# Altium project 24V_Supply.PrjPcb
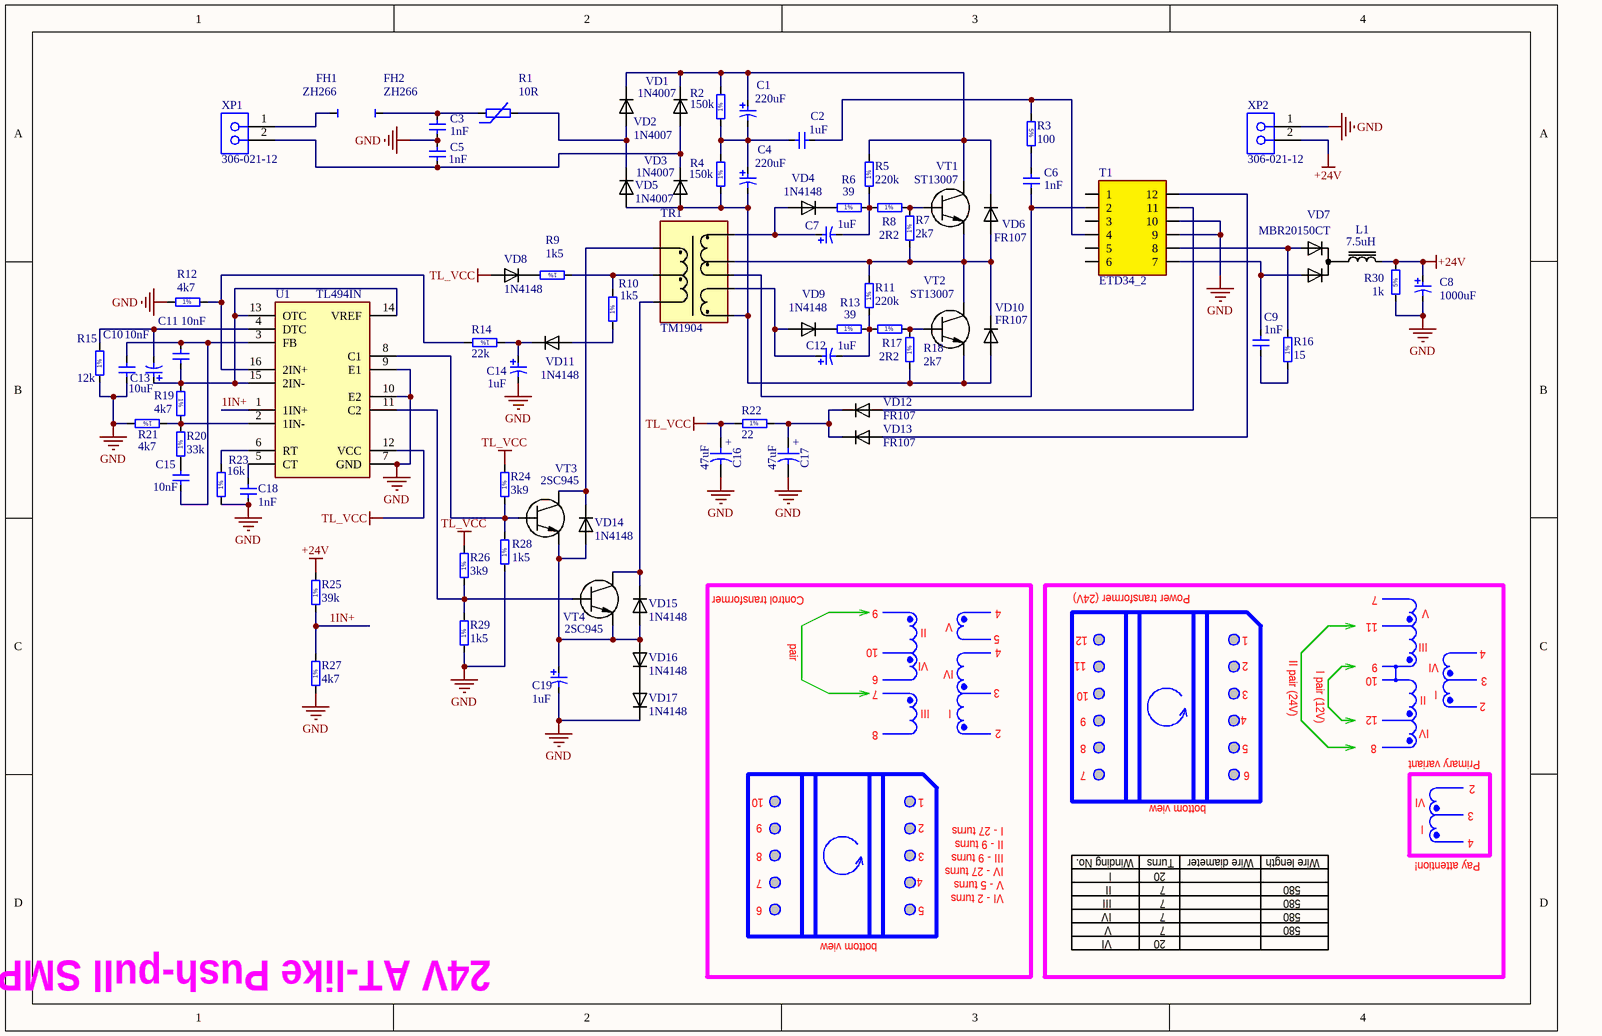
[diagram p0: 24V_Supply.SchDoc]
1 sheet, 78 parts. Net scope: global (net labels, ports and power ports of the same name join across sheets).
Board file: 24V_Supply.PcbDoc

## Sheet 24V_Supply.SchDoc
size A4

### Parts
C1  220uF  [CAP_EL_22_25_VERT]
C2  1uF  [CAPRR2000W80L2400T750H1500_CL21]
C3  1nF  [CAP_5.0MM]
C4  220uF  [CAP_EL_22_25_VERT]
C5  1nF  [CAP_5.0MM]
C6  1nF  [CAP_5.0MM]
C7  1uF  [CAP_EL_05_11_VERT]
C8  1000uF  [CAP_EL_13_20_VERT]
C9  1nF  [CAP_5.0MM]
C10  10nF  [CAP_5.0MM]
C11  10nF  [CAP_5.0MM]
C12  1uF  [CAP_EL_05_11_VERT]
C13  10uF  [CAP_EL_05_11_VERT]
C14  1uF  [CAP_EL_05_11_VERT]
C15  10nF  [CAP_5.0MM]
C16  47uF  [CAPPR250-500X1100]
C17  47uF  [CAPPR250-500X1100]
C18  1nF  [CAP_5.0MM]
C19  1uF  [CAP_EL_05_11_VERT]
FH1  ZH266  [ZH266]
FH2  ZH266  [ZH266]
L1  7.5uH  [DGS]
R1  10R  [B57164K]
R2  150k  [RES_AXIAL_0_25_8]
R3  100  [RES_VERT_2W_5]
R4  150k  [RES_AXIAL_0_25_8]
R5  220k  [RES_AXIAL_0_25_8]
R6  39  [RES_AXIAL_0_25_8]
R7  2k7  [RES_AXIAL_0_25_8]
R8  2R2  [RES_AXIAL_0_25_8]
R9  1k5  [RES_AXIAL_0_25_8]
R10  1k5  [RES_AXIAL_0_25_8]
R11  220k  [RES_AXIAL_0_25_8]
R12  4k7  [RES_AXIAL_0_25_8]
R13  39  [RES_AXIAL_0_25_8]
R14  22k  [RES_AXIAL_0_25_8]
R15  12k  [RES_AXIAL_0_25_8]
R16  15  [RES_AXIAL_0_25_8]
R17  2R2  [RES_AXIAL_0_25_8]
R18  2k7  [RES_AXIAL_0_25_8]
R19  4k7  [RES_AXIAL_0_25_8]
R20  33k  [RES_AXIAL_0_25_8]
R21  4k7  [RES_AXIAL_0_25_8]
R22  22  [RES_AXIAL_0_25_8]
R23  16k  [RES_AXIAL_0_25_8]
R24  3k9  [RES_AXIAL_0_25_8]
R25  39k  [RES_AXIAL_0_25_8]
R26  3k9  [RES_AXIAL_0_25_8]
R27  4k7  [RES_AXIAL_0_25_8]
R28  1k5  [RES_AXIAL_0_25_8]
R29  1k5  [RES_AXIAL_0_25_8]
R30  1k  [RES_VERT_2W_5]
T1  ETD34_2  [ETD34_2]
TR1  TM1904  [TM1904]
U1  TL494IN  [DIP16]
VD1  1N4007  [DO-41]
VD2  1N4007  [DO-41]
VD3  1N4007  [DO-41]
VD4  1N4148  [DO-35(300mil)]
VD5  1N4007  [DO-41]
VD6  FR107  [DO-41]
VD7  MBR20150CT  [TO-220-3]
VD8  1N4148  [DO-35(300mil)]
VD9  1N4148  [DO-35(300mil)]
VD10  FR107  [DO-41]
VD11  1N4148  [DO-35]
VD12  FR107  [DO-41 (8.5mm)]
VD13  FR107  [DO-41 (8.5mm)]
VD14  1N4148  [DO-35]
VD15  1N4148  [DO-35]
VD16  1N4148  [DO-35]
VD17  1N4148  [DO-35]
VT1  ST13007  [TO-220-3]
VT2  ST13007  [TO-220-3]
VT3  2SC945  [TO92]
VT4  2SC945  [TO92]
XP1  306-021-12  [306-021-12]
XP2  306-021-12  [306-021-12]

### Nets
+24V: C8.1 L1.2 R25.2 R30.2 XP2.2
GND: C3.1 C5.2 C8.2 C10.1 C14.2 C16.2 C17.2 C18.1 C19.2 R12.1 R15.1 R21.2 R23.1 R27.1 R28.1 R29.1 R30.1 T1.9 T1.10 U1.7(GND) U1.9(E1) U1.10(E2) VD17.K XP2.1
TL_VCC: C16.1 R22.1 R24.2 R26.2 U1.12(VCC) VD8.A
1IN+: R25.1 R27.2 U1.1(1IN+)
NetC1_1: C1.1 R2.2 R5.2 VD1.K VD2.K VD6.K VT1.2(C)
NetC1_2: C1.2 C2.1 C4.1 R2.1 R4.2
NetC2_2: C2.2 R3.1 T1.4
NetC3_2: C3.2 FH2.1 R1.1
NetC4_2: C4.2 R4.1 R18.1 TR1.7 VD3.A VD5.A VD10.A VT2.3(E)
NetC5_1: C5.1 VD1.A VD3.K XP1.2
NetC6_1: C6.1 T1.2 TR1.6
NetC6_2: C6.2 R3.2
NetC7_1: C7.1 TR1.9 VD4.A
NetC7_2: C7.2 R5.1 R6.2 R8.1
NetC9_1: C9.1 R16.1
NetC9_2: C9.2 T1.7 VD7.1(A)
NetC10_2: C10.2 C11.2 C15.1 U1.3(FB)
NetC11_1: C11.1 C13.1 R19.1 U1.13(OTC) U1.14(VREF) U1.15(2IN-)
NetC12_1: C12.1 TR1.8 VD9.A
NetC12_2: C12.2 R11.1 R13.2 R17.1
NetC13_2: C13.2 R15.2 U1.4(DTC)
NetC14_1: C14.1 R14.1 VD11.K
NetC15_2: C15.2 R20.1
NetC17_1: C17.1 R22.2 VD12.K VD13.K
NetC18_2: C18.2 U1.5(CT)
NetC19_1: C19.1 VD14.A VD15.A VD16.A VT3.3(E) VT4.3(E)
NetFH1_1: FH1.1 XP1.1
NetL1_1: L1.1 VD7.2(K)
NetR1_2: R1.2 VD2.A VD5.K
NetR6_1: R6.1 VD4.K
NetR7_1: R7.1 R11.2 TR1.10 VD6.A VD10.K VT1.3(E) VT2.2(C)
NetR7_2: R7.2 R8.2 VT1.1(B)
NetR9_1: R9.1 R10.2 TR1.3
NetR9_2: R9.2 VD8.K
NetR10_1: R10.1 VD11.A
NetR12_2: R12.2 R14.2 U1.16(2IN+)
NetR13_1: R13.1 VD9.K
NetR16_2: R16.2 T1.8 VD7.3(A)
NetR17_2: R17.2 R18.2 VT2.1(B)
NetR19_2: R19.2 R20.2 R21.1 U1.2(1IN-)
NetR23_2: R23.2 U1.6(RT)
NetR24_1: R24.1 R28.2 U1.8(C1) VT3.1(B)
NetR26_1: R26.1 R29.2 U1.11(C2) VT4.1(B)
NetT1_11: T1.11 VD12.A
NetT1_12: T1.12 VD13.A
NetTR1_2: TR1.2 VD15.K VT4.2(C)
NetTR1_4: TR1.4 VD14.K VT3.2(C)
NetVD16_K: VD16.K VD17.A

Not connected (* = marked no-connect by the designer): T1 1 3 5 6

### Notes on the sheet
- Power transformer (24V)
- pair
- Control transformer
- 9
- 10
- II
- VI
- V
- 5
- 4
- 11
- 12
- 1
- 2
- II pair (24V)
- 7
- III
- 6
- I
- IV
- 3
- I pair (12V)
- 8
- Primary variant
- I - 27 turns
- II - 9 turns
- III - 9 turns
- Winding No.
- Turns
- bottom view
- Wire diameter
- Wire length
- Pay attention!
- IV - 27 turns
- V - 5 turns
- VI - 2 turns
- 20
- 580
- 24V AT-like Push-pull SMPS
- (in symbol CAER_47UF_25V_20%_250-500X1100) +
- (in symbol RCF_100R_5%_2W_HB) 5%
- (in symbol RMF_1K5_1%_0.6W_50PPM_1016-630X250) 1%
- (in symbol RMF_2K7_1%_0.6W_50PPM_1016-630X250) 1%
- (in symbol RMF_2R2_1%_0.6W_50PPM_1016-630X250) 1%
- (in symbol RMF_3K9_1%_0.6W_50PPM_1016-630X250) 1%
- (in symbol RMF_4K7_1%_0.6W_50PPM_1016-630X250) 1%
- (in symbol RMF_12K_1%_0.6W_50PPM_1016-630X250) 1%
- (in symbol RMF_15R_1%_0.6W_50PPM_1016-630X250) 1%
- (in symbol RMF_16K_1%_0.6W_50PPM_1016-630X250) 1%
- (in symbol RMF_22K_1%_0.6W_50PPM_1016-630X250) 1%
- (in symbol RMF_22R_1%_0.6W_50PPM_1016-630X250) 1%
- (in symbol RMF_33K_1%_0.6W_50PPM_1016-630X250) 1%
- (in symbol RMF_39R_1%_0.6W_50PPM_1016-630X250) 1%
- (in symbol RMF_150K_1%_0.6W_50PPM_1016-630X250) 1%
- (in symbol RMF_220K_1%_0.6W_50PPM_1016-630X250) 1%

### Library data of the parts
C1 C4 = LG200M0220BPF-2225 (VERT MOUNTED): Voltage: 200V; Table: Electrolytic THD; Part Number: LG200M0220BPF-2225 (VERT MOUNTED); Value: 220uF
C2 = К73-17-250-1 10%: SMD 0805 Capacitor; Voltage: 250V; Table: Film; Part Number: К73-17-250-1 10%; Value: 1uF
C3 C5 C6 C9 = CK45-B3DD102KYNN: SMD 0805 Capacitor; Voltage: 2000V; Tolerance: ±10%; Table: Ceramic THD; Part Number: CK45-B3DD102KYNN; Value: 1nF
C7 C12 C14 C19 = SH050M1R00B2F-0511 (VERT MOUNTED): Voltage: 50V; Table: Electrolytic THD; Part Number: SH050M1R00B2F-0511 (VERT MOUNTED); Value: 1uF
C8 = SK035M1000B5S-1320 (VERT MOUNTED): Voltage: 35V; Table: Electrolytic THD; Part Number: SK035M1000B5S-1320 (VERT MOUNTED); Value: 1000uF
C10 C11 C15 = TS170R1H103K8BBB0R: SMD 0805 Capacitor; Voltage: 50V; Tolerance: ±10%; Table: Ceramic THD; Part Number: TS170R1H103K8BBB0R; Value: 10nF
C13 = SH050M0010B2F-0511 (VERT MOUNTED): Voltage: 50V; Table: Electrolytic THD; Part Number: SH050M0010B2F-0511 (VERT MOUNTED); Value: 10uF
C16 C17 = CAER_47UF_25V_20%_250-500X1100: Polarised capacitor; Part Description: Aluminum Electrolytic Capacitor; Manufacturer: GENERIC; Manufacturer1 Part Number: EEUFC1E470; Voltage: 25V; Tolerance: ±20%; Table: Capacitors THD; Part Number: CAER_47UF_25V_20%_250-500X1100; Component Kind: Standard; Component Type: Standard; Pin Count: 2; Value: 47uF; Status: Preferred; Manufacturer Part Number: CAER_47UF_25V_20%_250-500X1100; Case: LS2.5 D5 x H11; Mounted: Yes; Socket: No; SMD: No; ComponentHeight: 11mm; Manufacturer1 Example: PANASONIC; Manufacturer1 ComponentHeight: 11mm; HelpURL: \\cern.ch\dfs\Applications\Altium\Datasheets\CAER_PANASONIC_FC.pdf; Author: CERN DEM JLC; CreateDate: 18.12.2007; LatestRevisionDate: 18.12.2007
C18 = TS170R1H102JSBNB0R: SMD 0805 Capacitor; Voltage: 50V; Tolerance: ±5%; Table: Ceramic THD; Part Number: TS170R1H102JSBNB0R; Value: 1nF
FH1 FH2 = ZH266: Table: OTHER; Part Number: ZH266; Family: ZH266; Device: ZH266
L1 = DGS: Part Description: 7.5uH/0.02 Om/10 A; Tolerance: ± 10%; Table: Inductors THD; Part Number: DGS; Value: 7.5uH
R1 = B57164K: Table: NTC; Part Number: B57164K; Value: 10R
R2 R4 = RMF_150K_1%_0.6W_50PPM_1016-630X250: Part Description: Leaded Metal Film Resistor; Manufacturer: GENERIC; Manufacturer1 Part Number: MBB02070C1503FCT00; Power: 0.6W; TC: ±50ppm/°C; Tolerance: ±1%; Table: THD; Part Number: RMF_150K_1%_0.6W_50PPM_1016-630X250; Component Kind: Standard; Component Type: Standard; Pin Count: 2; Value: 150k; Status: Preferred; Manufacturer Part Number: RMF_150K_1%_0.6W_50PPM_1016-630X250; Case: LS10.16 L6.3 x D2.5; Mounted: Yes; Socket: No; SMD: No; ComponentHeight: 2.5mm; Manufacturer1 Example: VISHAY BEYSCHLAG; Manufacturer1 ComponentHeight: 2.5mm; HelpURL: \\cern.ch\dfs\Applications\Altium\Datasheets\RMF_VISHAY_MBB0207.pdf; Author: CERN DEM JLC; CreateDate: 04.12.2007; LatestRevisionDate: 07.04.2008
R3 R30 = RCF_100R_5%_2W_HB: Table: THD; Part Number: RCF_100R_5%_2W_HB; Component Kind: Standard; Component Type: Standard
  R3: Value: 100
  R30: Value: 1k
R5 R11 = RMF_220K_1%_0.6W_50PPM_1016-630X250: Part Description: Leaded Metal Film Resistor; Manufacturer: GENERIC; Manufacturer1 Part Number: MBB02070C2203FCT00; Power: 0.6W; TC: ±50ppm/°C; Tolerance: ±1%; Table: THD; Part Number: RMF_220K_1%_0.6W_50PPM_1016-630X250; Component Kind: Standard; Component Type: Standard; Pin Count: 2; Value: 220k; Status: Preferred; Manufacturer Part Number: RMF_220K_1%_0.6W_50PPM_1016-630X250; Case: LS10.16 L6.3 x D2.5; Mounted: Yes; Socket: No; SMD: No; ComponentHeight: 2.5mm; Manufacturer1 Example: VISHAY BEYSCHLAG; Manufacturer1 ComponentHeight: 2.5mm; HelpURL: \\cern.ch\dfs\Applications\Altium\Datasheets\RMF_VISHAY_MBB0207.pdf; Author: CERN DEM JLC; CreateDate: 04.12.2007; LatestRevisionDate: 07.04.2008
R6 R13 = RMF_39R_1%_0.6W_50PPM_1016-630X250: Part Description: Leaded Metal Film Resistor; Manufacturer: GENERIC; Manufacturer1 Part Number: MBB02070C3909FCT00; Power: 0.6W; TC: ±50ppm/°C; Tolerance: ±1%; Table: THD; Part Number: RMF_39R_1%_0.6W_50PPM_1016-630X250; Component Kind: Standard; Component Type: Standard; Pin Count: 2; Value: 39; Status: Preferred; Manufacturer Part Number: RMF_39R_1%_0.6W_50PPM_1016-630X250; Case: LS10.16 L6.3 x D2.5; Mounted: Yes; Socket: No; SMD: No; ComponentHeight: 2.5mm; Manufacturer1 Example: VISHAY BEYSCHLAG; Manufacturer1 ComponentHeight: 2.5mm; HelpURL: \\cern.ch\dfs\Applications\Altium\Datasheets\RMF_VISHAY_MBB0207.pdf; Author: CERN DEM JLC; CreateDate: 04.12.2007; LatestRevisionDate: 07.04.2008
R7 R18 = RMF_2K7_1%_0.6W_50PPM_1016-630X250: Part Description: Leaded Metal Film Resistor; Manufacturer: GENERIC; Manufacturer1 Part Number: MBB02070C2701FCT00; Power: 0.6W; TC: ±50ppm/°C; Tolerance: ±1%; Table: THD; Part Number: RMF_2K7_1%_0.6W_50PPM_1016-630X250; Component Kind: Standard; Component Type: Standard; Pin Count: 2; Value: 2k7; Status: Preferred; Manufacturer Part Number: RMF_2K7_1%_0.6W_50PPM_1016-630X250; Case: LS10.16 L6.3 x D2.5; Mounted: Yes; Socket: No; SMD: No; ComponentHeight: 2.5mm; Manufacturer1 Example: VISHAY BEYSCHLAG; Manufacturer1 ComponentHeight: 2.5mm; HelpURL: \\cern.ch\dfs\Applications\Altium\Datasheets\RMF_VISHAY_MBB0207.pdf; Author: CERN DEM JLC; CreateDate: 04.12.2007; LatestRevisionDate: 07.04.2008
R8 R17 = RMF_2R2_1%_0.6W_50PPM_1016-630X250: Part Description: Leaded Metal Film Resistor; Manufacturer: GENERIC; Manufacturer1 Part Number: MBB02070C2208FCT00; Power: 0.6W; TC: ±50ppm/°C; Tolerance: ±1%; Table: THD; Part Number: RMF_2R2_1%_0.6W_50PPM_1016-630X250; Component Kind: Standard; Component Type: Standard; Pin Count: 2; Value: 2R2; Status: Preferred; Manufacturer Part Number: RMF_2R2_1%_0.6W_50PPM_1016-630X250; Case: LS10.16 L6.3 x D2.5; Mounted: Yes; Socket: No; SMD: No; ComponentHeight: 2.5mm; Manufacturer1 Example: VISHAY BEYSCHLAG; Manufacturer1 ComponentHeight: 2.5mm; HelpURL: \\cern.ch\dfs\Applications\Altium\Datasheets\RMF_VISHAY_MBB0207.pdf; Author: CERN DEM JLC; CreateDate: 04.12.2007; LatestRevisionDate: 07.04.2008
R9 R10 R28 R29 = RMF_1K5_1%_0.6W_50PPM_1016-630X250: Part Description: Leaded Metal Film Resistor; Manufacturer: GENERIC; Manufacturer1 Part Number: MBB02070C1501FCT00; Power: 0.6W; TC: ±50ppm/°C; Tolerance: ±1%; Table: THD; Part Number: RMF_1K5_1%_0.6W_50PPM_1016-630X250; Component Kind: Standard; Component Type: Standard; Pin Count: 2; Value: 1k5; Status: Preferred; Manufacturer Part Number: RMF_1K5_1%_0.6W_50PPM_1016-630X250; Case: LS10.16 L6.3 x D2.5; Mounted: Yes; Socket: No; SMD: No; ComponentHeight: 2.5mm; Manufacturer1 Example: VISHAY BEYSCHLAG; Manufacturer1 ComponentHeight: 2.5mm; HelpURL: \\cern.ch\dfs\Applications\Altium\Datasheets\RMF_VISHAY_MBB0207.pdf; Author: CERN DEM JLC; CreateDate: 04.12.2007; LatestRevisionDate: 07.04.2008
R12 R19 R21 R27 = RMF_4K7_1%_0.6W_50PPM_1016-630X250: Part Description: Leaded Metal Film Resistor; Manufacturer: GENERIC; Manufacturer1 Part Number: MBB02070C4701FCT00; Power: 0.6W; TC: ±50ppm/°C; Tolerance: ±1%; Table: THD; Part Number: RMF_4K7_1%_0.6W_50PPM_1016-630X250; Component Kind: Standard; Component Type: Standard; Pin Count: 2; Value: 4k7; Status: Preferred; Manufacturer Part Number: RMF_4K7_1%_0.6W_50PPM_1016-630X250; Case: LS10.16 L6.3 x D2.5; Mounted: Yes; Socket: No; SMD: No; ComponentHeight: 2.5mm; Manufacturer1 Example: VISHAY BEYSCHLAG; Manufacturer1 ComponentHeight: 2.5mm; HelpURL: \\cern.ch\dfs\Applications\Altium\Datasheets\RMF_VISHAY_MBB0207.pdf; Author: CERN DEM JLC; CreateDate: 04.12.2007; LatestRevisionDate: 07.04.2008
R14 R25 = RMF_22K_1%_0.6W_50PPM_1016-630X250: Part Description: Leaded Metal Film Resistor; Manufacturer: GENERIC; Manufacturer1 Part Number: MBB02070C2202FCT00; Power: 0.6W; TC: ±50ppm/°C; Tolerance: ±1%; Table: THD; Part Number: RMF_22K_1%_0.6W_50PPM_1016-630X250; Component Kind: Standard; Component Type: Standard; Pin Count: 2; Status: Preferred; Manufacturer Part Number: RMF_22K_1%_0.6W_50PPM_1016-630X250; Case: LS10.16 L6.3 x D2.5; Mounted: Yes; Socket: No; SMD: No; ComponentHeight: 2.5mm; Manufacturer1 Example: VISHAY BEYSCHLAG; Manufacturer1 ComponentHeight: 2.5mm; HelpURL: \\cern.ch\dfs\Applications\Altium\Datasheets\RMF_VISHAY_MBB0207.pdf; Author: CERN DEM JLC; CreateDate: 04.12.2007; LatestRevisionDate: 07.04.2008
  R14: Value: 22k
  R25: Value: 39k
R15 = RMF_12K_1%_0.6W_50PPM_1016-630X250: Part Description: Leaded Metal Film Resistor; Manufacturer: GENERIC; Manufacturer1 Part Number: MBB02070C1202FCT00; Power: 0.6W; TC: ±50ppm/°C; Tolerance: ±1%; Table: THD; Part Number: RMF_12K_1%_0.6W_50PPM_1016-630X250; Component Kind: Standard; Component Type: Standard; Pin Count: 2; Value: 12k; Status: Preferred; Manufacturer Part Number: RMF_12K_1%_0.6W_50PPM_1016-630X250; Case: LS10.16 L6.3 x D2.5; Mounted: Yes; Socket: No; SMD: No; ComponentHeight: 2.5mm; Manufacturer1 Example: VISHAY BEYSCHLAG; Manufacturer1 ComponentHeight: 2.5mm; HelpURL: \\cern.ch\dfs\Applications\Altium\Datasheets\RMF_VISHAY_MBB0207.pdf; Author: CERN DEM JLC; CreateDate: 04.12.2007; LatestRevisionDate: 07.04.2008
R16 = RMF_15R_1%_0.6W_50PPM_1016-630X250: Part Description: Leaded Metal Film Resistor; Manufacturer: GENERIC; Manufacturer1 Part Number: MBB02070C1509FCT00; Power: 0.6W; TC: ±50ppm/°C; Tolerance: ±1%; Table: THD; Part Number: RMF_15R_1%_0.6W_50PPM_1016-630X250; Component Kind: Standard; Component Type: Standard; Pin Count: 2; Value: 15; Status: Preferred; Manufacturer Part Number: RMF_15R_1%_0.6W_50PPM_1016-630X250; Case: LS10.16 L6.3 x D2.5; Mounted: Yes; Socket: No; SMD: No; ComponentHeight: 2.5mm; Manufacturer1 Example: VISHAY BEYSCHLAG; Manufacturer1 ComponentHeight: 2.5mm; HelpURL: \\cern.ch\dfs\Applications\Altium\Datasheets\RMF_VISHAY_MBB0207.pdf; Author: CERN DEM JLC; CreateDate: 04.12.2007; LatestRevisionDate: 07.04.2008
R20 = RMF_33K_1%_0.6W_50PPM_1016-630X250: Part Description: Leaded Metal Film Resistor; Manufacturer: GENERIC; Manufacturer1 Part Number: MBB02070C3302FCT00; Power: 0.6W; TC: ±50ppm/°C; Tolerance: ±1%; Table: THD; Part Number: RMF_33K_1%_0.6W_50PPM_1016-630X250; Component Kind: Standard; Component Type: Standard; Pin Count: 2; Value: 33k; Status: Preferred; Manufacturer Part Number: RMF_33K_1%_0.6W_50PPM_1016-630X250; Case: LS10.16 L6.3 x D2.5; Mounted: Yes; Socket: No; SMD: No; ComponentHeight: 2.5mm; Manufacturer1 Example: VISHAY BEYSCHLAG; Manufacturer1 ComponentHeight: 2.5mm; HelpURL: \\cern.ch\dfs\Applications\Altium\Datasheets\RMF_VISHAY_MBB0207.pdf; Author: CERN DEM JLC; CreateDate: 04.12.2007; LatestRevisionDate: 07.04.2008
R22 = RMF_22R_1%_0.6W_50PPM_1016-630X250: Part Description: Leaded Metal Film Resistor; Manufacturer: GENERIC; Manufacturer1 Part Number: MBB02070C2209FCT00; Power: 0.6W; TC: ±50ppm/°C; Tolerance: ±1%; Table: THD; Part Number: RMF_22R_1%_0.6W_50PPM_1016-630X250; Component Kind: Standard; Component Type: Standard; Pin Count: 2; Value: 22; Status: Preferred; Manufacturer Part Number: RMF_22R_1%_0.6W_50PPM_1016-630X250; Case: LS10.16 L6.3 x D2.5; Mounted: Yes; Socket: No; SMD: No; ComponentHeight: 2.5mm; Manufacturer1 Example: VISHAY BEYSCHLAG; Manufacturer1 ComponentHeight: 2.5mm; HelpURL: \\cern.ch\dfs\Applications\Altium\Datasheets\RMF_VISHAY_MBB0207.pdf; Author: CERN DEM JLC; CreateDate: 04.12.2007; LatestRevisionDate: 07.04.2008
R23 = RMF_16K_1%_0.6W_50PPM_1016-630X250: Part Description: Leaded Metal Film Resistor; Manufacturer: GENERIC; Manufacturer1 Part Number: MBB02070C1602FCT00; Power: 0.6W; TC: ±50ppm/°C; Tolerance: ±1%; Table: THD; Part Number: RMF_16K_1%_0.6W_50PPM_1016-630X250; Component Kind: Standard; Component Type: Standard; Pin Count: 2; Value: 16k; Status: Preferred; Manufacturer Part Number: RMF_16K_1%_0.6W_50PPM_1016-630X250; Case: LS10.16 L6.3 x D2.5; Mounted: Yes; Socket: No; SMD: No; ComponentHeight: 2.5mm; Manufacturer1 Example: VISHAY BEYSCHLAG; Manufacturer1 ComponentHeight: 2.5mm; HelpURL: \\cern.ch\dfs\Applications\Altium\Datasheets\RMF_VISHAY_MBB0207.pdf; Author: CERN DEM JLC; CreateDate: 04.12.2007; LatestRevisionDate: 07.04.2008
R24 R26 = RMF_3K9_1%_0.6W_50PPM_1016-630X250: Part Description: Leaded Metal Film Resistor; Manufacturer: GENERIC; Manufacturer1 Part Number: MBB02070C3901FCT00; Power: 0.6W; TC: ±50ppm/°C; Tolerance: ±1%; Table: THD; Part Number: RMF_3K9_1%_0.6W_50PPM_1016-630X250; Component Kind: Standard; Component Type: Standard; Pin Count: 2; Value: 3k9; Status: Preferred; Manufacturer Part Number: RMF_3K9_1%_0.6W_50PPM_1016-630X250; Case: LS10.16 L6.3 x D2.5; Mounted: Yes; Socket: No; SMD: No; ComponentHeight: 2.5mm; Manufacturer1 Example: VISHAY BEYSCHLAG; Manufacturer1 ComponentHeight: 2.5mm; HelpURL: \\cern.ch\dfs\Applications\Altium\Datasheets\RMF_VISHAY_MBB0207.pdf; Author: CERN DEM JLC; CreateDate: 04.12.2007; LatestRevisionDate: 07.04.2008
T1 = ETD34/2: Table: Cores; Part Number: ETD34/2; Value: ETD34_2
TR1 = TM1904: Table: Cores; Part Number: TM1904; Value: TM1904
U1 = TL494IN: Table: Analog and Interface; Part Number: TL494IN; Device: TL494IN
VD1-VD3 VD5 = 1N4007_HOR: Table: Diode; Part Number: 1N4007_HOR; Device: 1N4007
VD4 VD8 VD9 = 1N4148 (300mil): Table: Diode; Part Number: 1N4148 (300mil); Device: 1N4148
VD6 VD10 VD12 VD13 = FR107 (HOR MOUNTED): Table: Diode; Part Number: FR107 (HOR MOUNTED); Device: FR107
VD7 = MBR20150CT: Table: Diode; Part Number: MBR20150CT; Device: MBR20150CT
VD11 VD14-VD17 = 1N4148: Table: Diode; Part Number: 1N4148; Device: 1N4148
VT1 VT2 = ST13007: Part Description: NPN 400В/8А/80Вт; Table: Transistors; Part Number: ST13007; Component Kind: Standard; Component Type: Standard; Device: ST13007; Footprint: TO220AB; Status: Active; Case: TO-220-3; Mounted: Yes; Socket: No; SMD: Yes; Author: I. Kuznetsov
VT3 VT4 = 2SC945: Table: Transistors; Part Number: 2SC945; Device: 2SC945
XP1 XP2 = 306-021-12: Table: DEGSON; Part Number: 306-021-12; Family: DG306; Device: 306-021-12